# Altium project Hardware-Smartwatch.PrjPcb
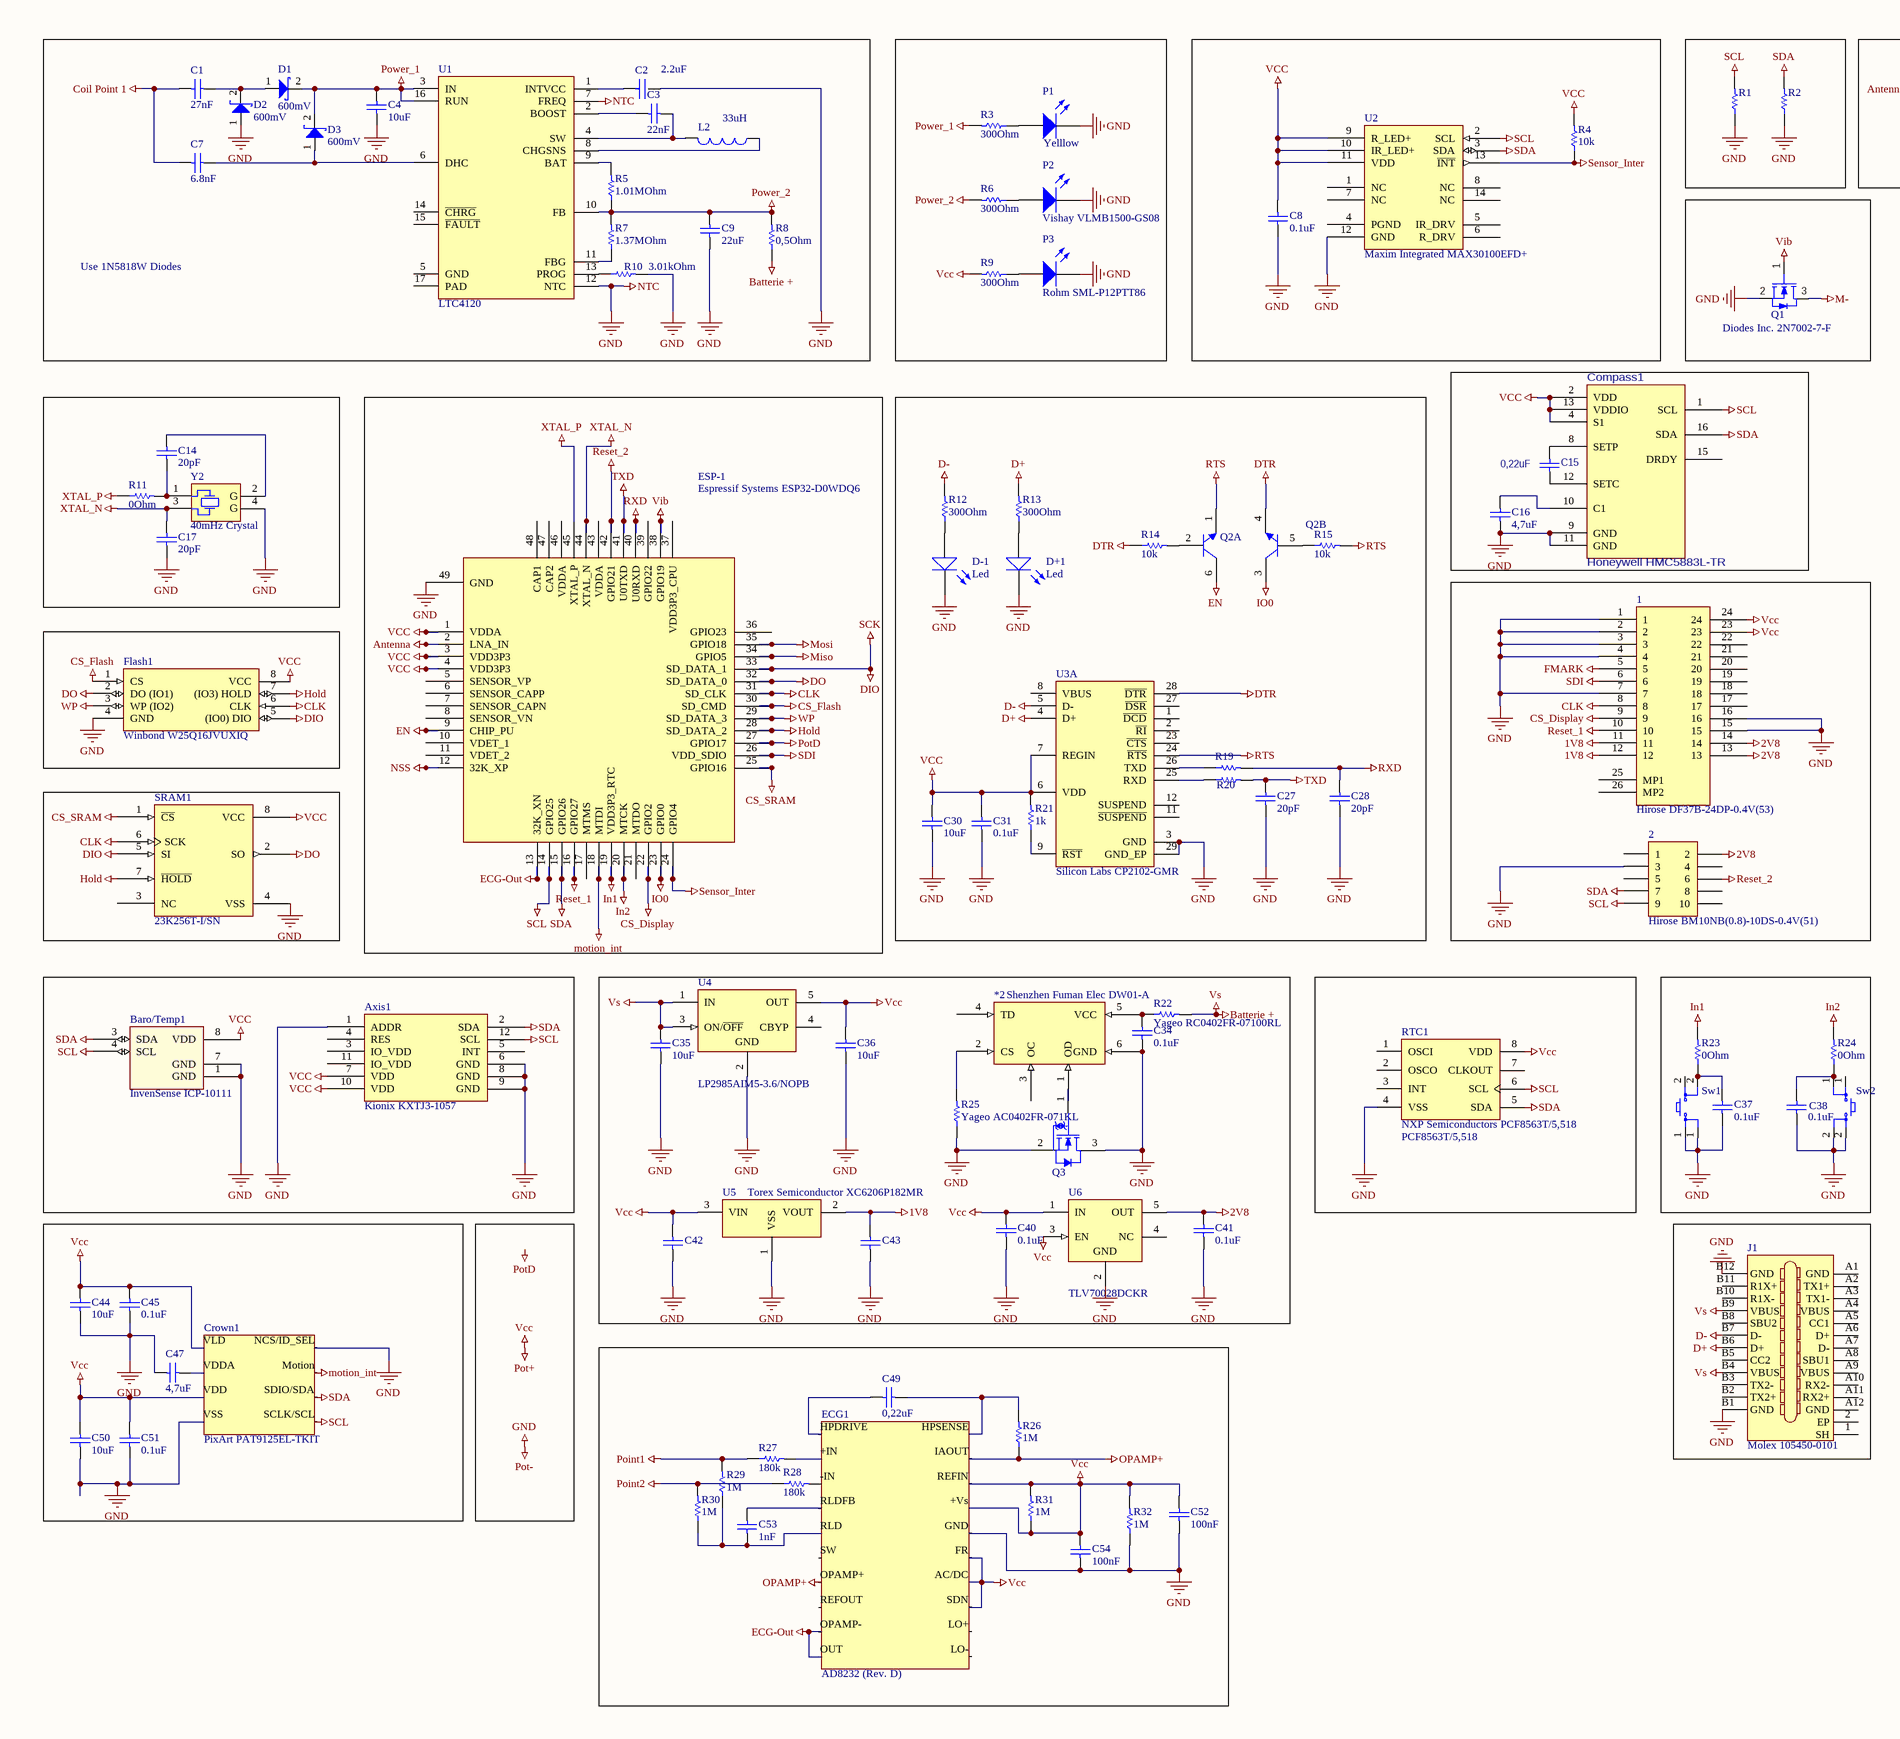
[diagram p0: Prototype1.SchDoc, left]
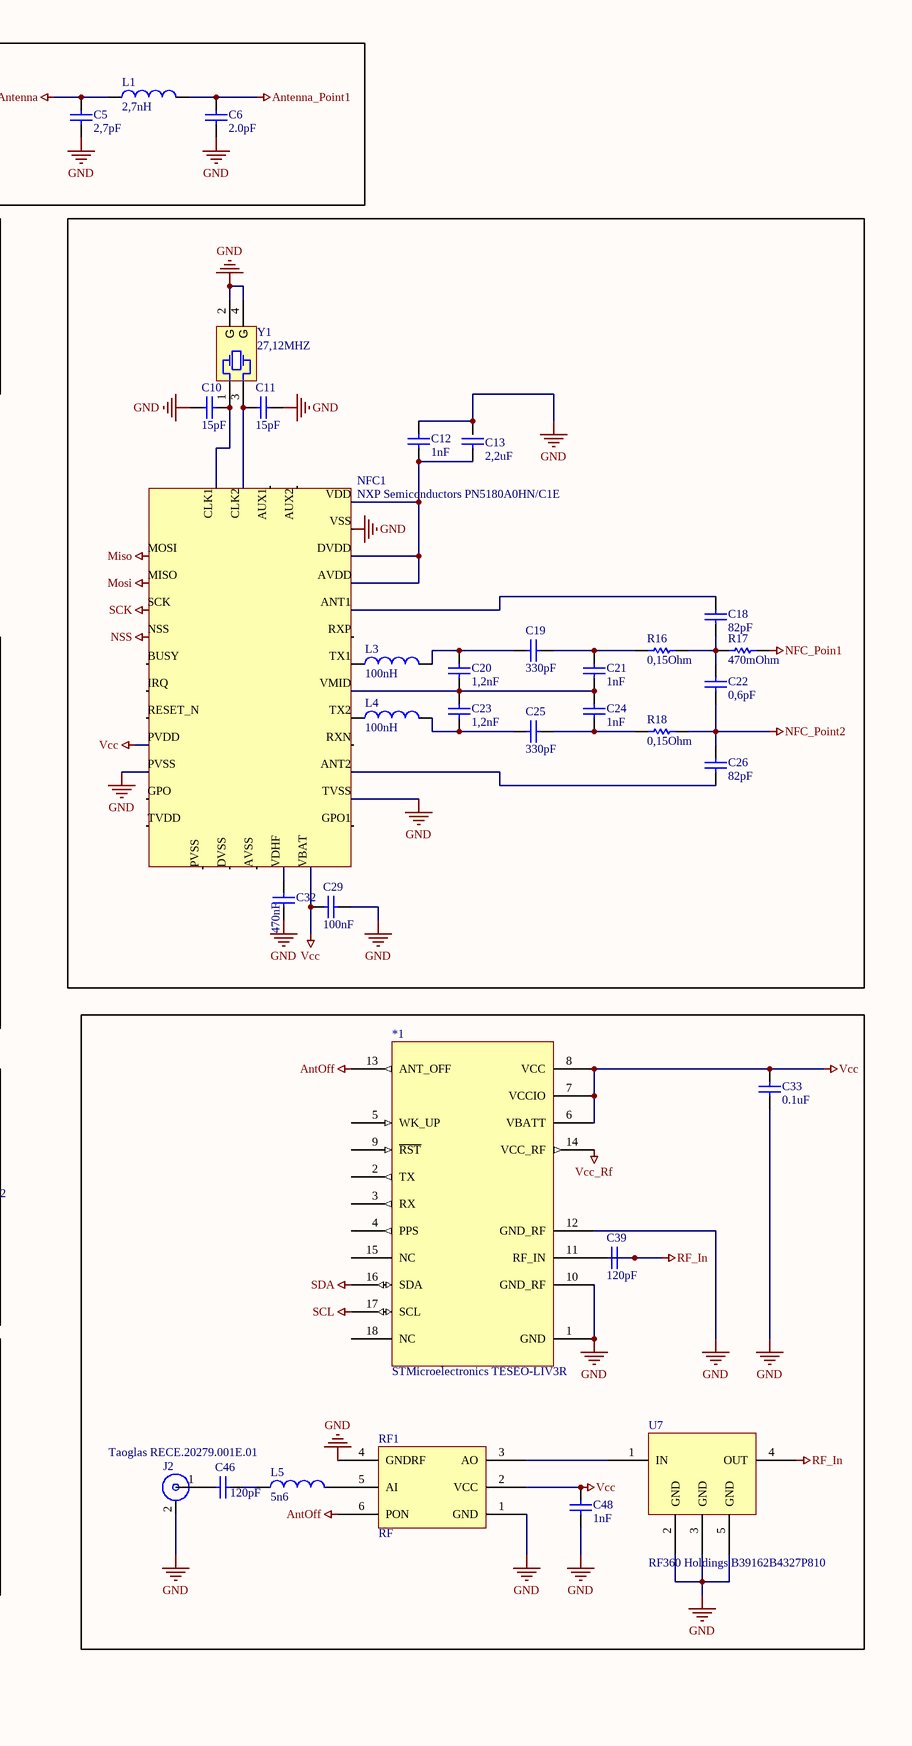
[diagram p1: Prototype1.SchDoc, right]
1 sheet, 130 parts. Net scope: global (net labels, ports and power ports of the same name join across sheets).

## Sheet Prototype1.SchDoc
size A2; SheetNumber: 1; SheetTotal: 1

### Parts
1  Hirose DF37B-24DP-0.4V(53)  [PCBComponent_1]
2  Hirose BM10NB(0.8)-10DS-0.4V(51)  [PCB-u3zw0tki9uf6kmg31iqn-1]
*1  STMicroelectronics TESEO-LIV3R  [PCB-u3hgvlwbh1fojz4efx6r-1]
*2  Shenzhen Fuman Elec DW01-A  [SOT-23-OT6_M]
Axis1  Kionix KXTJ3-1057  [LGA-12]
Baro/Temp1  InvenSense ICP-10111  [LGA]
C1  27nF  [CAPC1005X60X30LL05T10]
C2  2.2uF  [PCBComponent_1]
C3  22nF  [CAPC1005X55X25ML05T10]
C4  10uF  [PCB-lttyq4g1lvuzst7phzli-1]
C5  2,7pF  [CAPC0603X33X15NL03T05]
C6  2.0pF  [CAPC1005X55X25LL05T10]
C7  6.8nF  [CAPC1005X55X30ML05T10]
C8  0.1uF  [PCB-4i05r4rk4159wp88m495-1]
C9  22uF  [PCB-b20vf2gkp97cr3yguehn-1]
C10  15pF  [PCB-wc38oeditvpn9r3qsjf8-1]
C11  15pF  [PCB-wc38oeditvpn9r3qsjf8-1]
C12  1nF  [CAPC1005X56X25NL10T15]
C13  2,2uF  [PCBComponent_1]
C14  20pF  [PCB-rnv6v97ozil7y8g0pmlh-1]
C15  0,22uF  [Samsung CL05A224KO5NNNC-Footprint-1]
C16  4,7uF  [PCB-igt9wm9mf6kdh4ygcups-1]
C17  20pF  [PCB-rnv6v97ozil7y8g0pmlh-1]
C18  82pF  [CAPC1005X55X25LL05T10]
C19  330pF  [CAPC1005X55X25LL05T10]
C20  1,2nF  [CAPC1005X55X25NL05T10]
C21  1nF  [CAPC1005X56X25NL10T15]
C22  0,6pF  [CAPC1005X55X25ML05T10]
C23  1,2nF  [CAPC1005X55X25NL05T10]
C24  1nF  [CAPC1005X56X25NL10T15]
C25  330pF  [CAPC1005X55X25LL05T10]
C26  82pF  [CAPC1005X55X25LL05T10]
C27  20pF  [PCB-rnv6v97ozil7y8g0pmlh-1]
C28  20pF  [PCB-rnv6v97ozil7y8g0pmlh-1]
C29  100nF  [PCB-b20vf2gkp97cr3yguehn-1]
C30  10uF  [PCB-a41llqp6xpt8gy62f2hk-1]
C31  0.1uF  [PCB-4i05r4rk4159wp88m495-1]
C32  470nF  [PCB-8tuutlkq7p1aj3t2dfdp-1]
C33  0.1uF  [PCB-4i05r4rk4159wp88m495-1]
C34  0.1uF  [PCB-4i05r4rk4159wp88m495-1]
C35  10uF  [PCB-lttyq4g1lvuzst7phzli-1]
C36  10uF  [PCB-lttyq4g1lvuzst7phzli-1]
C37  0.1uF  [PCB-4i05r4rk4159wp88m495-1]
C38  0.1uF  [PCB-4i05r4rk4159wp88m495-1]
C39  120pF  [CAPC1005X55X25NL05T10]
C40  0.1uF  [PCB-4i05r4rk4159wp88m495-1]
C41  0.1uF  [PCB-4i05r4rk4159wp88m495-1]
C42  (no value)  [PCB-2o8y9rvhkwcvfcailoy7-1]
C43  (no value)  [PCB-2o8y9rvhkwcvfcailoy7-1]
C44  10uF  [PCB-lttyq4g1lvuzst7phzli-1]
C45  0.1uF  [PCB-4i05r4rk4159wp88m495-1]
C46  120pF  [CAPC1005X55X25NL05T10]
C47  4,7uF  [PCB-9qymwl9t0y1bq7iwb9rx-1]
C48  1nF  [CAPC1005X56X25NL10T15]
C49  0,22uF  [CAPC1005X55X25NL05T10]
C50  10uF  [PCB-lttyq4g1lvuzst7phzli-1]
C51  0.1uF  [PCB-4i05r4rk4159wp88m495-1]
C52  100nF  [PCB-b20vf2gkp97cr3yguehn-1]
C53  1nF  [CAPC1005X56X25NL10T15]
C54  100nF  [PCB-b20vf2gkp97cr3yguehn-1]
Compass1  Honeywell HMC5883L-TR  [PCB-2968744-2]
Crown1  PixArt PAT9125EL-TKIT  [PixArt PAT9125EL-TKIT-Footprint-1]
D1  600mV  [ONSC-SOD-123-2-425-04_V]
D2  600mV  [ONSC-SOD-123-2-425-04_V]
D3  600mV  [ONSC-SOD-123-2-425-04_V]
D+1  Led  [LED-0402]
D-1  Led  [LED-0402]
ECG1  AD8232 (Rev. D)  [New footprint 1]
ESP-1  Espressif Systems ESP32-D0WDQ6  [PCB-i0ipgkgimgjttn9ruy0i-1]
Flash1  Winbond W25Q16JVUXIQ  [MXIC-USON-8_V]
J1  Molex 105450-0101  [PCB-zuuv2u5tezfwori2z0s2-1]
J2  Taoglas RECE.20279.001E.01  [PCB-golsi5rrai9s3p77h0ow-1]
L1  2,7nH  [PCB-4fmjq88xgxe0pf6g45vt-1]
L2  33uH  [PCB-crnfwttg3wkipbuqaprv-1]
L3  100nH  [CAPC1005X60X30LL05T10]
L4  100nH  [CAPC1005X60X30LL05T10]
L5  5n6  [INDC1005X06N]
NFC1  NXP Semiconductors PN5180A0HN/C1E  [NXP Semiconductors PN5180A0HN_C1E-Footprint-1]
P1  Yelllow  [PCB-89oypsq879wwpt3swtto-1]
P2  Vishay VLMB1500-GS08  [PCB-5g2cap63tq137py3r0gr-1]
P3  Rohm SML-P12PTT86  [PCB-fvln992s2sfnqnba174z-1]
Q1  Diodes Inc. 2N7002-7-F  [PCB-mndh2ao1q7oim2ifpjxf-1]
Q2  (no value)  [ONSC-SOT-363-6-419B-02_W_V]  (parts A,B of 2)
Q3  (no value)  [PCB-wwee15y6zmt5extocly2-1]
R1  (no value)  [RESC1005X37X25LL05T10]
R2  (no value)  [RESC1005X37X25LL05T10]
R3  300Ohm  [RESC1005X40X25ML05T10]
R4  10k  [RESC1005X37X25NL05T10]
R5  1.01MOhm  [PCB-1tvcz1kgsq38xqp5t8gc-1]
R6  300Ohm  [RESC1005X40X25ML05T10]
R7  1.37MOhm  [RESC3116X65X40NL10T20]
R8  0,5Ohm  [RESC1005X40X25ML10T10]
R9  300Ohm  [RESC1005X40X25ML05T10]
R10  3.01kOhm  [RESC1005X40X25ML05T05]
R11  0Ohm  [Yageo RC0402FR-070RL-Footprint-2]
R12  300Ohm  [RESC1005X40X25ML05T10]
R13  300Ohm  [RESC1005X40X25ML05T10]
R14  10k  [RESC1005X37X25NL05T10]
R15  10k  [RESC1005X37X25NL05T10]
R16  0,15Ohm  [RESC1005X40X25LL10T10]
R17  470mOhm  [RESC1005X40X25ML10T10]
R18  0,15Ohm  [RESC1005X40X25LL10T10]
R19  (no value)  [Yageo RC0402FR-070RL-Footprint-2]
R20  (no value)  [Yageo RC0402FR-070RL-Footprint-2]
R21  1k  [RESC1005X37X25LL05T10]
R22  Yageo RC0402FR-07100RL  [RESC1005X40X20NL05T10]
R23  0Ohm  [Yageo RC0402FR-070RL-Footprint-2]
R24  0Ohm  [Yageo RC0402FR-070RL-Footprint-2]
R25  Yageo AC0402FR-071KL  [RESC1005X37X25LL05T10]
R26  1M  [RESC1005X40X25NL05T10]
R27  180k  [0402R]
R28  180k  [0402R]
R29  1M  [RESC1005X40X25NL05T10]
R30  1M  [RESC1005X40X25NL05T10]
R31  1M  [RESC1005X40X25NL05T10]
R32  1M  [RESC1005X40X25NL05T10]
RF1  RF  [PCB-h91j38j7fiz7nduy8522-1]
RTC1  NXP Semiconductors PCF8563T/5,518  Manufacturer Part Number: PCF8563T/5,518  [PCB-mkdigkdyo5adg2mbgdfg-1]
SRAM1  23K256T-I/SN  [SOIC-SN8_M]
Sw1  (no value)  [PCB-9lguhjxtz3hxtv6sow1n-1]
Sw2  (no value)  [PCB-9lguhjxtz3hxtv6sow1n-1]
U1  LTC4120  [PCB-zah3is8l8nrgpohakmjs-1]
U2  Maxim Integrated MAX30100EFD+  [OLGA14]
U3  Silicon Labs CP2102-GMR  [QFN50P500X500X100_HS-29N]  (part A of 2)
U4  LP2985AIM5-3.6/NOPB  [MF05A_L]
U5  Torex Semiconductor XC6206P182MR  [SOT-23-3]
U6  TLV70028DCKR  [TI-DCK5_V]
U7  RF360 Holdings B39162B4327P810  [RF360 Holdings B39162B4327P810-Footprint-1]
Y1  27,12MHZ  [PCB-56e43dtnb7esksvnne1a-1]
Y2  40mHz Crystal  [DFN160P250X80-4N]

### Blocks framed on the sheet
Use 1N5818W Diodes: C1-C4 C7 C9 D1-D3 L2 R5 R7 R8 R10 U1

### Nets
1V8: 1.11 1.12 C43.2 U5.2(VOUT)
2V8: 1.13 1.14 2.2 C41.2 U6.5(OUT)
Antenna: C5.2 ESP-1.2(LNA_IN) L1.1
Antenna_Point1: C6.2 L1.2
AntOff: *1.13(ANT_OFF) RF1.6(PON)
Batterie +: C35.2 J1.B4(VBUS) J1.B9(VBUS) R8.1 R22.2 U4.1(IN) U4.3(ON/~{OFF})  [also labelled Vs]
CLK: 1.8 ESP-1.31(SD_CLK) Flash1.6(CLK) SRAM1.6(SCK)
Coil Point 1: C1.1 C7.1
CS_Display: 1.9 ESP-1.22(GPIO2)
CS_Flash: ESP-1.30(SD_CMD) Flash1.1(CS)
CS_SRAM: ESP-1.25(GPIO16) SRAM1.1(~{CS})
D+: J1.B6(D+) R13.2 U3.4(D+)
D-: J1.B7(D-) R12.2 U3.5(D-)
DIO: ESP-1.33(SD_DATA_1) Flash1.5((IO0)_DIO) NFC1.SCK SRAM1.5(SI)  [also labelled SCK]
DO: ESP-1.32(SD_DATA_0) Flash1.2(DO_(IO1)) SRAM1.2(SO)
DTR: Q2.4(E) R14.1 U3.28(~{DTR})
ECG-Out: ECG1.OPAMP- ECG1.OUT ESP-1.13(32K_XN)
EN: ESP-1.9(CHIP_PU) Q2.6(C)
FMARK: 1.5
GND: 1.1 1.2 1.3 1.4 1.7 1.15 1.16 2.3 *1.1(GND) *1.10(GND_RF) *1.12(GND_RF) *2.6(GND) Axis1.1(ADDR) Axis1.6(GND) Axis1.8(GND) Axis1.9(GND) Baro/Temp1.1(GND) Baro/Temp1.2(RESV) Baro/Temp1.5(RESV) Baro/Temp1.6(RESV) Baro/Temp1.7(GND) C2.2 C4.1 C5.1 C6.1 C8.1 C9.1 C10.2 C11.2 C12.1 C13.2 C16.1 C17.2 C27.2 C28.2 C29.1 C30.1 C31.1 C32.1 C33.1 C34.1 C35.1 C36.1 C37.1 C38.1 C40.1 C41.1 C42.1 C43.1 C44.1 C45.1 C47.1 C48.1 C50.1 C51.1 C52.1 C54.1 Compass1.9(GND) Compass1.11(GND) Crown1.NCS/ID_SEL Crown1.VSS D2.1(A) D+1.C D-1.C ECG1.GND ESP-1.49(GND) Flash1.4(GND) J1.B1(GND) J1.B12(GND) J2.2 NFC1.PVSS NFC1.TVSS NFC1.VSS P1.1(K) P2.2(K) P3.1(K) Q1.2(S) Q3.2(S) Q3.3(D) R1.1 R2.1 R10.2 R25.1 R32.1 RF1.1(GND) RF1.4(GNDRF) RTC1.4(VSS) SRAM1.4(VSS) Sw1.1 Sw2.2(2A) U1.7(FREQ) U1.12(NTC) U2.12(GND) U3.3(GND) U3.29(GND_EP) U4.2(GND) U5.1(VSS) U6.2(GND) U7.2(GND) U7.3(GND) U7.5(GND) Y1.2(GND) Y1.4(GND) Y2.4(GND)  [also labelled NTC, Pot-]
Hold: ESP-1.28(SD_DATA_2) Flash1.7((IO3)_HOLD) SRAM1.7(~{HOLD})
In1: ESP-1.19(VDD3P3_RTC) R23.2
In2: ESP-1.20(MTCK) R24.2
IO0: ESP-1.23(GPIO0) Q2.3(C)
M-: Q1.3(D)
Miso: ESP-1.34(GPIO5) NFC1.MOSI
Mosi: ESP-1.35(GPIO18) NFC1.MISO
motion_int: Crown1.Motion ESP-1.18(MTDI)
NFC_Poin1: R17.2
NFC_Point2: C22.1 C26.2 R18.2
NSS: ESP-1.12(32K_XP) NFC1.NSS
OPAMP+: ECG1.IAOUT ECG1.OPAMP+ R26.1
Point1: R27.1 R29.2
Point2: R28.1 R30.2
Pot+: 1.23 1.24 *1.6(VBATT) *1.7(VCCIO) *1.8(VCC) Axis1.7(VDD) Axis1.10(VDD) Baro/Temp1.8(VDD) C8.2 C29.2 C30.2 C31.2 C33.2 C36.2 C40.2 C42.2 C44.2 C45.2 C48.2 C50.2 C51.2 C52.2 C54.2 Compass1.2(VDD) Compass1.4(S1) Compass1.13(VDDIO) Crown1.VDD Crown1.VLD ECG1.+Vs ECG1.AC/DC ECG1.FR ECG1.REFIN ECG1.SDN ESP-1.1(VDDA) ESP-1.3(VDD3P3) ESP-1.4(VDD3P3) Flash1.8(VCC) NFC1.PVDD NFC1.VBAT R4.2 R9.2 R21.2 R31.1 R31.2 R32.2 RF1.2(VCC) RTC1.8(VDD) SRAM1.8(VCC) U2.9(R_LED+) U2.10(IR_LED+) U2.11(VDD) U3.6(VDD) U3.7(REGIN) U4.5(OUT) U5.3(VIN) U6.1(IN) U6.3(EN)  [also labelled VCC]
PotD: ESP-1.27(GPIO17)
Power_1: C4.2 D1.2(K) D3.2(K) R3.2 U1.3(IN) U1.16(RUN)
Power_2: C9.2 R5.1 R6.2 R7.2 R8.2 U1.10(FB)
Reset_1: 1.10 ESP-1.16(GPIO27)
Reset_2: 2.6 ESP-1.42(GPIO21)
RF_In: C39.1 U7.4(OUT)
RTS: Q2.1(E) R15.2 U3.24(~{RTS})
RXD: C28.1 ESP-1.40(U0RXD) R19.2
SCL: 2.9 *1.17(SCL) Axis1.12(SCL) Baro/Temp1.4(SCL) Compass1.1(SCL) Crown1.SCLK/SCL ESP-1.14(GPIO25) R1.2 RTC1.6(SCL) U2.2(SCL)
SDA: 2.7 *1.16(SDA) Axis1.2(SDA) Baro/Temp1.3(SDA) Compass1.16(SDA) Crown1.SDIO/SDA ESP-1.15(GPIO26) R2.2 RTC1.5(SDA) U2.3(SDA)
SDI: 1.6 ESP-1.26(VDD_SDIO)
Sensor_Inter: ESP-1.24(GPIO4) R4.1 U2.13(~{INT})
TXD: C27.1 ESP-1.41(U0TXD) R20.2
Vcc_Rf: *1.14(VCC_RF)
Vib: ESP-1.38(GPIO19) Q1.1(G)
WP: ESP-1.29(SD_DATA_3) Flash1.3(WP_(IO2))
XTAL_N: C17.1 ESP-1.44(XTAL_N) Y2.3
XTAL_P: ESP-1.45(XTAL_P) R11.1
Net*1_11: *1.11(RF_IN) C39.2
Net*2_1: *2.1(OD) Q3.1(G)
Net*2_2: *2.2(CS) R25.2
Net*2_5: *2.5(VCC) C34.2 R22.1
NetC1_2: C1.2 D1.1(A) D2.2(K)
NetC2_1: C2.1 U1.1(INTVCC)
NetC3_1: C3.1 L2.2 U1.4(SW)
NetC3_2: C3.2 U1.2(BOOST)
NetC7_2: C7.2 D3.1(A) U1.6(DHC)
NetC10_1: C10.1 NFC1.CLK1 Y1.1
NetC11_1: C11.1 NFC1.CLK2 Y1.3
NetC12_2: C12.2 C13.1 NFC1.AVDD NFC1.DVDD NFC1.VDD
NetC14_1: C14.1 Y2.2(GND)
NetC14_2: C14.2 R11.2 Y2.1
NetC15_1: C15.1 Compass1.12(SETC)
NetC15_2: C15.2 Compass1.8(SETP)
NetC16_2: C16.2 Compass1.10(C1)
NetC18_1: C18.1 C22.2 R16.2 R17.1
NetC18_2: C18.2 NFC1.ANT1
NetC19_1: C19.1 C20.2 L3.2
NetC19_2: C19.2 C21.2 R16.1
NetC20_1: C20.1 C21.1 C23.2 C24.2 NFC1.VMID
NetC23_1: C23.1 C25.1 L4.2
NetC24_1: C24.1 C25.2 R18.1
NetC26_1: C26.1 NFC1.ANT2
NetC32_2: C32.2 NFC1.VDHF
NetC37_2: C37.2 R23.1 Sw1.2(2A)
NetC38_2: C38.2 R24.1 Sw2.1
NetC46_1: C46.1 J2.1
NetC46_2: C46.2 L5.1
NetC47_2: C47.2 Crown1.VDDA
NetC49_1: C49.1 ECG1.HPDRIVE
NetC49_2: C49.2 ECG1.HPSENSE R26.2
NetC53_1: C53.1 ECG1.RLD R29.1 R30.1
NetC53_2: C53.2 ECG1.RLDFB
NetD+1_A: D+1.A R13.1
NetD-1_A: D-1.A R12.1
NetECG1_+IN: ECG1.+IN R27.2
NetECG1_-IN: ECG1.-IN R28.2
NetL2_1: L2.1 U1.8(CHGSNS)
NetL3_1: L3.1 NFC1.TX1
NetL4_1: L4.1 NFC1.TX2
NetL5_2: L5.2 RF1.5(AI)
NetP1_2: P1.2(A) R3.1
NetP2_1: P2.1(A) R6.1
NetP3_2: P3.2(A) R9.1
NetQ2_2: Q2.2(B) R14.2
NetQ2_5: Q2.5(B) R15.1
NetR5_2: R5.2 U1.9(BAT)
NetR7_1: R7.1 U1.11(FBG)
NetR10_1: R10.1 U1.13(PROG)
NetR19_1: R19.1 U3.26(TXD)
NetR20_1: R20.1 U3.25(RXD)
NetR21_1: R21.1 U3.9(~{RST})
NetRF1_3: RF1.3(AO) U7.1(IN)

Not connected (* = marked no-connect by the designer): 1 17 18 19 20 21 22 25(MP1) 26(MP2); 2 1 4 5 8 10; *1 2(TX) 3(RX) 4(PPS) 5(WK_UP) 9(~{RST}) 15(NC) 18(NC); *2 3(OC) 4(TD); Axis1 3(IO_VDD) 4(RES) 5(INT) 11(IO_VDD); Compass1 15(DRDY); ECG1 LO+ LO- REFOUT SW; ESP-1 5(SENSOR_VP) 6(SENSOR_CAPP) 7(SENSOR_CAPN) 8(SENSOR_VN) 10(VDET_1) 11(VDET_2) 17(MTMS) 21(MTDO) 36(GPIO23) 37(VDD3P3_CPU) 39(GPIO22) 43(VDDA) 46(VDDA) 47(CAP2) 48(CAP1); J1 1(SH) 2(EP) A1(GND) A2(TX1+) A3(TX1-) A4(VBUS) A5(CC1) A6(D+) A7(D-) A8(SBU1) A9(VBUS) A10(RX2-) A11(RX2+) A12(GND) B2(TX2+) B3(TX2-) B5(CC2) B8(SBU2) B10(R1X-) B11(R1X+); NFC1 AUX1 AUX2 AVSS BUSY DVSS GPO GPO1 IRQ RESET_N RXN RXP TVDD; RTC1 1(OSCI) 2(OSCO) 3(INT) 7(CLKOUT); SRAM1 3(NC); U1 5(GND) 14(~{CHRG}) 15(~{FAULT}) 17(PAD); U2 1(NC) 4(PGND) 5(IR_DRV) 6(R_DRV) 7(NC) 8(NC) 14(NC); U3 1(~{DCD}) 2(~{RI}) 8(VBUS) 11(~{SUSPEND}) 12(SUSPEND) 23(~{CTS}) 27(~{DSR}); U4 4(CBYP); U6 4(NC)

### Notes on the sheet
- Labels drawn without touching a wire or pin: PotD
- (in symbol CMP-6073a867ade6bfb4-1) G
- (in symbol CMP-lm3x3di7cwhelc99d68i-2) G

### Library data of the parts
1 = CMP-8e184631a11551df-1: Conn Board to Board HDR 24 POS 0.4mm Solder ST SMD Embossed T/R; Lead-Free Status: Lead Free; Gender: Male; RoHS: Compliant; Octopart URL: https://octopart.com/df37b-24dp-0.4v%2853%29-hirose-19073643; Manufacturer Part Number: DF37B-24DP-0.4V(53); Footprint: PCB-b3nupnfmlm5i4i0jm9x8-1; Contact Material: Phosphor Bronze; OctopartID: 8e184631a11551df; Packaging: Reel; Contact Plating: Gold; Mounting Style: Surface Mount
2 = CMP-679fafb648a7b858-4: Conn Board to Board RCP 10 POS 0.4mm Solder ST SMD Embossed T/R; Gender: Female; Contact Material: Phosphor Bronze; Manufacturer Part Number: BM10NB(0.8)-10DS-0.4V(51); RoHS: Compliant; OctopartID: 679fafb648a7b858; Contact Plating: Gold; Mounting Style: Surface Mount; Packaging: Reel; Octopart URL: http://octopart.com/bm10nb%280.8%29-10ds-0.4v%2851%29-hirose-19073630; Footprint: PCB-u3zw0tki9uf6kmg31iqn-3
*1 = CMP-2292ed94a740fd55-1: GPS Receiver 1575.42MHz 4.3V Automotive 18-Pin LLCC T/R; Octopart URL: https://octopart.com/teseo-liv3r-stmicroelectronics-101490868; OctopartID: 2292ed94a740fd55; Lifecycle Status: Not Listed by Manufacturer; Manufacturer Part Number: TESEO-LIV3R
*2 = CMP-20a0eece0df0ff67-1: SOT-23-6 Battery Management ICs ROHS; Octopart Url: https://octopart.com/dw01-a-shenzhen+fuman+elec-123996214; OctopartID: 20a0eece0df0ff67; Manufacturer Part Number: DW01-A
Axis1 = CMP-a0826d1fa6c97f45-10: Tri-Axis, User Selectable ± 2g, 4g, 8g, 16g, Digital (I2C) Interface and Motion; Supply Voltage (DC): 1.71 V (min), 3.60 V (max); Lead-Free Status: Lead Free; RoHS: Compliant; Packaging: Cut Tape (CT); Manufacturer Part Number: KXTJ3-1057; Octopart URL: https://octopart.com/kxtj3-1057-kionix-77013805; Footprint: PCB-19646338-12; OctopartID: a0826d1fa6c97f45
Baro/Temp1 = CMP-b01e7c8a0af36fd9-2: Barometric Pressure/Temperature Sensor Digital 30kPa to 110kPa/-20 to 65°C 8-Pin LGA T/R; Manufacturer Part Number: ICP-10111; Octopart URL: https://octopart.com/icp-10111-invensense-94281611; OctopartID: b01e7c8a0af36fd9; Footprint: PCB-xjhigi64ti04gzxyhg29-1
C1 = CMP-124778-2: CAP CER 0.027UF 16V 5% X7R 0402; Manufacturer Part Number: C0402C273J4RACTU; Capacitance: 2.7e-08 F; Dielectric Material: Ceramic; Lead-Free Status: R; Voltage Rating (DC): 16.0 V; Capacitance Tolerance: ±5%; Case/Package: 0402; Dielectric Characteristic: X7R; Mounting Style: Surface Mount; Octopart Url: https://octopart.com/c0402c273j4ractu-kemet-17308055; OctopartID: f4c03cc2c8312b07; RoHS: Compliant
C2 C13 = CMP-eb9423b056183453-1: Cap Ceramic 2.2uF 6.3V X5R 20% SMD 0402 85°C Paper T/R; Manufacturer Part Number: CL05A225MQ5NSNC; Lead-Free Status: Lead Free; Footprint: PCB-snmx76k49jswq4nvgt6h-1; Octopart URL: https://octopart.com/cl05a225mq5nsnc-samsung-19831018; OctopartID: eb9423b056183453; RoHS: Compliant
C3 = CMP-3558712-2: Multilayer Ceramic Capacitors MLCC - SMD/SMT 0.022uF 25Volts X7R 10%; Manufacturer Part Number: GCM155R71E223KA55J; Capacitance: 2.2e-08 F; Voltage Rating (DC): 25.0 V; Capacitance Tolerance: ±10%; Dielectric Characteristic: X7R; Octopart Url: https://octopart.com/gcm155r71e223ka55j-murata-17909662; OctopartID: e91e21058be636d9; RoHS: Compliant
C4 C35 C36 C44 C50 = CMP-eacb22ede71a350c-10: Multilayer Ceramic Capacitors MLCC - SMD/SMT 10UF 6.3V 20% 0402; Manufacturer Part Number: GRM155R60J106ME44D; Lead-Free Status: Lead Free; Dielectric Characteristic: X5R; Voltage Rating (DC): 6.30 V; Capacitance: 10.0 µF; Size-Width: 500 µm; Size-Thickness: 500 µm; Operating Temperature: -55.0 °C to 85.0 °C; Case/Package: 0402; REACH SVHC Compliance: No SVHC; OctopartID: eacb22ede71a350c; Capacitance Tolerance: ±20%; Mounting Style: Surface Mount; Size-Length: 1.00 mm; RoHS: Compliant; Octopart URL: https://octopart.com/grm155r60j106me44d-murata-19671223; Packaging: Cut Tape (CT), Tape & Reel (TR)
C5 = CMP-8248623-2: Multilayer Ceramic Capacitors MLCC - SMD/SMT 0201 2.7pF 25volts C0G +/-0.25pF; Manufacturer Part Number: GRM0335C1E2R7CA01D; Capacitance: 2.7e-12 F; Case/Package (SI): 0603; Dielectric Characteristic: C0G/NP0; Lead-Free Status: Lead Free; Voltage Rating (DC): 25.0 V; Lifecycle Status: Active; Octopart Url: https://octopart.com/grm0335c1e2r7ca01d-murata-24611300; OctopartID: 8f4d473023cf508a; RoHS: Compliant; Size-Length: 0.0006 m; Size-Thickness: 0.0003 m; Size-Width: 0.0003 m
C6 = CMP-2265470-2: Multilayer Ceramic Capacitors MLCC - SMD/SMT 0402 2.0pF 50Volts C0G +/-0.1pF; Manufacturer Part Number: GJM1555C1H2R0BB01D; Capacitance: 2e-12 F; Dielectric Characteristic: C0G/NP0; Lead-Free Status: Lead Free; Voltage Rating (DC): 50.0 V; Number of Pins: 2; Octopart Url: https://octopart.com/gjm1555c1h2r0bb01d-murata-4680453; OctopartID: 1601df4c5862c9c6; Packaging: Cut Tape (CT); REACH SVHC Compliance: No SVHC; RoHS: Compliant; Size-Length: 0.001 m; Size-Thickness: 0.0005 m; Size-Width: 0.0005 m
C7 = CMP-124295-2: CAP CER 6800PF 50V 10% X7R 0402; Manufacturer Part Number: C0402C682K5RACTU; Capacitance: 6.8e-09 F; Dielectric Material: Ceramic; Lead-Free Status: R; Voltage Rating (DC): 50.0 V; Capacitance Tolerance: ±10%; Case/Package: 0402; Dielectric Characteristic: X7R; Mounting Style: Surface Mount; Number of Pins: 2; Octopart Url: https://octopart.com/c0402c682k5ractu-kemet-101578; OctopartID: 9ad553de33794512; Packaging: Cut Tape (CT); REACH SVHC Compliance: No SVHC; RoHS: Compliant; Size-Height: 0.0005 m; Size-Length: 0.001 m; Size-Width: 0.0005 m
C8 C31 C33 C34 C37 C38 C40 C41 C45 C51 = CMP-492b82a5f65d96ec-4: 0402 0.1 uF 16 V ±10 % Tolerance X7R SMT Multilayer Ceramic Capacitor; Manufacturer Part Number: CC0402KRX7R7BB104; Capacitance Tolerance: ±10%; Voltage Rating (DC): 16.0 V; Lead-Free Status: Lead Free; Capacitance: 100 nF; REACH SVHC Compliance: No SVHC; Packaging: Cut Tape (CT), Tape & Reel (TR); RoHS: Compliant; Operating Temperature: -55.0 °C to 125 °C; Halogen Free Status: Halogen Free; Mounting Style: Surface Mount; Octopart URL: https://octopart.com/cc0402krx7r7bb104-yageo-42244624; Dielectric Characteristic: X7R; Number of Pins: 2; Case/Package: 0402; OctopartID: 492b82a5f65d96ec
C9 = CMP-2342ef2b2152fc85-1: Cap Ceramic 22uF 6.3V X5R 20% SMD 0402 85°C Paper T/R; Manufacturer Part Number: CC0402MRX5R5BB226; Lead-Free Status: Lead Free; Capacitance: 22.0 µF; Voltage Rating (DC): 6.30 V; Capacitance Tolerance: ±20%; RoHS: Compliant; Case/Package: 0402; Value: 22uF; OctopartID: 2342ef2b2152fc85; Dielectric Characteristic: X5R; Mounting Style: Surface Mount; Octopart URL: https://octopart.com/cc0402mrx5r5bb226-yageo-90384246; Halogen Free Status: Halogen Free
C10 C11 = CMP-cb1f0298578c14d8-1: 0805 15 pF 50 V ±5 % Tolerance NPO Surface Mount Ceramic Capacitor; Manufacturer Part Number: CC0805JRNPO9BN150; Voltage Rating (DC): 50.0 V; Dielectric Characteristic: C0G/NP0; Capacitance Tolerance: ±5%; Lead-Free Status: Lead Free; Capacitance: 1.5e-11 F; OctopartID: cb1f0298578c14d8; Case/Package: 0805; Octopart URL: http://octopart.com/cc0805jrnpo9bn150-yageo-9288181; Number of Pins: 2; RoHS: Compliant; Halogen Free Status: Halogen Free; Mounting Style: Surface Mount
C12 C21 C24 C48 C53 = CMP-3a37f3b0aa79e5f0-2: Surface Mount Ceramic Multilayer Capacitor 0.001uF 5% X7R 50V 0402 Paper T/R; Manufacturer Part Number: CC0402JRX7R9BB102; Capacitance: 1.00 nF; Voltage Rating (DC): 50.0 V; Lead-Free Status: Lead Free; Footprint: PCB-0002-00476-3; Case/Package: 0402; Packaging: Cut Tape (CT); OctopartID: 3a37f3b0aa79e5f0; Octopart URL: https://octopart.com/cc0402jrx7r9bb102-yageo-9286952; Capacitance Tolerance: ±5%; RoHS: Compliant; Dielectric Characteristic: X7R; Operating Temperature: -55.0 °C to 125 °C; Mounting Style: Surface Mount; Halogen Free Status: Halogen Free; Number of Pins: 2
C14 C17 C27 C28 = CMP-c23c0bbb515b1dfb-3: 0402 20 pF 50 V ±5 % Tolerance NP0 SMT Multilayer Ceramic Capacitor; Manufacturer Part Number: CC0402JRNPO9BN200; Voltage Rating (DC): 50.0 V; Dielectric Characteristic: C0G/NP0; Lead-Free Status: Lead Free; Capacitance: 20.0 pF; Capacitance Tolerance: ±5%; OctopartID: c23c0bbb515b1dfb; RoHS: Compliant; Octopart Url: http://octopart.com/cc0402jrnpo9bn200-yageo-9287169; Seller Landing  Url: https://octopart-clicks.com/click/track?country=US&ak=8157f166&sig=0db7fc5&sid=1106&ppid=9287169&vpid=198823824&ct=offers; Packaging: Cut Tape (CT); Mounting Style: Surface Mount; Number of Pins: 2; Case/Package: 0402; Halogen Free Status: Halogen Free; Footprint: PCB-p33n3j6uepxmkh02isin-1
C15 = CMP-775fbf298173a898-2: CL05 Series 0402 0.22 uF 16 V ±10% X5R Multilayer Ceramic Capacitor; Manufacturer Part Number: CL05A224KO5NNNC; Lead-Free Status: Lead Free; Capacitance: 220 nF; Voltage Rating (DC): 16.0 V; Case/Package: 0402; Capacitance Tolerance: ±10%; Mounting Style: Surface Mount; Octopart Url: https://octopart.com/cl05a224ko5nnnc-samsung-24957770; Operating Temperature: -55.0 °C (min); Dielectric Characteristic: X5R; OctopartID: 775fbf298173a898; Packaging: Tape & Reel (TR); RoHS: Compliant
C16 = CMP-5caa96c6827f836d-4: 4.7µF ±20% 10V Ceramic Capacitor X5R 0402 (1005 Metric); Manufacturer: Yageo; Manufacturer Part Number: CC0402MRX5R6BB475; Lead-Free Status: Lead Free; Voltage Rating (DC): 10.0 V; Capacitance: 4.7uF; RoHS: Compliant; Dielectric Characteristic: X5R; Halogen Free Status: Halogen Free; Packaging: Tape & Reel (TR); Case/Package: 0402; Octopart URL: https://octopart.com/cc0402mrx5r6bb475-yageo-57080755; Capacitance Tolerance: ±20%; Mounting Style: Surface Mount; OctopartID: 5caa96c6827f836d; Supplier Part Number: 311-1734-2-ND; Supplier: Digi-Key
C18 C26 = CMP-2511185-3: Multilayer Ceramic Capacitors MLCC - SMD/SMT 0402 82pF 50volts C0G 5%; Manufacturer Part Number: GRM1555C1H820JA01D; Manufacturer: Murata; Voltage Rating (DC): 50.0 V; Capacitance: 8.2e-11 F; Lead-Free Status: Lead Free; Dielectric Characteristic: C0G/NP0; OctopartID: f00039fa98732fc7; REACH SVHC Compliance: No SVHC; Size-Thickness: 0.0005 m; Capacitance Tolerance: ±5%; Octopart Url: https://octopart.com/grm1555c1h820ja01d-murata-15748373; RoHS: Compliant; Lifecycle Status: Active; Size-Width: 0.0005 m; Size-Length: 0.001 m
C19 C25 = CMP-132420-2: CAP CER 330PF 100V 10% X7R 0402; Manufacturer Part Number: GRM155R72A331KA01D; Capacitance: 3.3e-10 F; Lead-Free Status: Lead Free; Voltage Rating (DC): 100.0 V; Capacitance Tolerance: ±10%; Dielectric Characteristic: X7R; Lifecycle Status: Active; Octopart Url: https://octopart.com/grm155r72a331ka01d-murata-17746408; OctopartID: 1be6d3e2f768c421; RoHS: Compliant; Size-Length: 0.001 m; Size-Thickness: 0.0005 m; Size-Width: 0.0005 m
C20 C23 = CMP-134898-2: Multilayer Ceramic Capacitors MLCC - SMD/SMT 0402 1200pF 10volt U2J +/-5%; Manufacturer Part Number: GRM1557U1A122JA01D; Capacitance: 1.2e-09 F; Capacitance Tolerance: ±5%; Voltage Rating (DC): 10.0 V; Dielectric Characteristic: U2J; Lifecycle Status: Active; Octopart Url: https://octopart.com/grm1557u1a122ja01d-murata-17757707; OctopartID: 94275c23474a4be0; RoHS: Compliant; Size-Length: 0.001 m; Size-Thickness: 0.0005 m; Size-Width: 0.0005 m
C22 = CMP-3552115-2: Multilayer Ceramic Capacitors MLCC - SMD/SMT 0402 0.60pF 50volts C0G +/-0.1pF; Manufacturer Part Number: GRM1555C1HR60BA01D; Capacitance: 6e-13 F; Dielectric Characteristic: C0G/NP0; Voltage Rating (DC): 50.0 V; Lifecycle Status: Active; Octopart Url: https://octopart.com/grm1555c1hr60ba01d-murata-19769333; OctopartID: e99321b46b003654; RoHS: Compliant; Size-Length: 0.001 m; Size-Thickness: 0.0005 m; Size-Width: 0.0005 m
C29 C52 C54 = CMP-fe6237170bbd21a5-3: 0402 0.1 uF 10 V ±10 % Tolerance X5R SMT Multilayer Ceramic Capacitor; Manufacturer Part Number: CC0402KRX5R6BB104; Voltage Rating (DC): 10.0 V; Lead-Free Status: Lead Free; Capacitance Tolerance: ±10%; Value: 0.1uF; Packaging: Cut Tape (CT); OctopartID: fe6237170bbd21a5; Octopart URL: https://octopart.com/cc0402krx5r6bb104-yageo-8376505; RoHS: Compliant; Operating Temperature: -55.0 °C to 85.0 °C; Dielectric Characteristic: X5R; Halogen Free Status: Halogen Free; Number of Pins: 2; Capacitance: 100 nF; Case/Package: 0402; Mounting Style: Surface Mount
C30 = CMP-fd5e350784e62299-2: Cap Ceramic 10uF 6.3V X5R 20% SMD 0402 85°C Paper T/R; Manufacturer Part Number: CL05A106MQ5NUNC; Lead-Free Status: Lead Free; RoHS: Compliant; Mounting Style: Surface Mount; Octopart URL: https://octopart.com/cl05a106mq5nunc-samsung-22240478; OctopartID: fd5e350784e62299
C32 = CMP-1106d88296b6cec1-2: Cap Ceramic 0.47uF 10V X5R 10% SMD 0402 85°C Paper T/R; Manufacturer Part Number: CL05A474KP5NNNC; Lead-Free Status: Lead Free; Voltage Rating (DC): 10.0 V; Capacitance: 470 nF; Octopart URL: https://octopart.com/cl05a474kp5nnnc-samsung-9347798; Operating Temperature: -55.0 °C (min); Footprint: PCB-8tuutlkq7p1aj3t2dfdp-7; RoHS: Compliant; Capacitance Tolerance: ±10%; Case/Package: 0402; Dielectric Characteristic: X5R; OctopartID: 1106d88296b6cec1
C39 C46 = CMP-132550-2: Multilayer Ceramic Capacitors MLCC - SMD/SMT 120pF 50Volts C0G 5%; Manufacturer Part Number: GCM1555C1H121JA16D; Capacitance: 1.2e-10 F; Dielectric Characteristic: C0G/NP0; Voltage Rating (DC): 50.0 V; Capacitance Tolerance: ±5%; Octopart Url: https://octopart.com/gcm1555c1h121ja16d-murata-17802270; OctopartID: 66e4aee1e79cb923; RoHS: Compliant
C42 C43 = CMP-1984d046933ec643-1: 0402 1 uF 16 V ±10% Tolerance X5R SMT Multilayer Ceramic Capacitor; Manufacturer Part Number: EMK105BJ105KV-F; Lead-Free Status: Lead Free; Voltage Rating (DC): 16.0 V; Capacitance: 1.00 µF; Operating Temperature: -55.0 °C to 85.0 °C; Packaging: Cut Tape (CT); Lifecycle Status: Active; Dielectric Characteristic: X5R; REACH SVHC Compliance: No SVHC; Halogen Free Status: Halogen Free; Octopart URL: https://octopart.com/emk105bj105kv-f-taiyo+yuden-13152220; RoHS: Compliant; Mounting Style: Surface Mount; Case/Package: 0402; Number of Pins: 2; OctopartID: 1984d046933ec643; Capacitance Tolerance: ±10%
C47 = CMP-120737-5: Capacitor: ceramic; 4.7uF; 6.3V; X5R; ±20%; SMD; 0402; Series: GRM; Manufacturer Part Number: GRM155R60J475ME87D; Lead-Free Status: Lead Free; Capacitance: 4.70 µF; Voltage Rating (DC): 6.30 V; Octopart URL: http://octopart.com/grm155r60j475me87d-murata-12608427; Capacitance Tolerance: ±20%; Size-Length: 1.00 mm; Size-Thickness: 500 µm; REACH SVHC Compliance: No SVHC; Lifecycle Status: Active; Packaging: Cut Tape (CT), Tape & Reel (TR); Dielectric Characteristic: X5R; RoHS: Compliant; Size-Width: 500 µm; Case/Package: 0402, 1005; Mounting Style: Surface Mount; OctopartID: aa9d6357ec50755a
C49 = CMP-bd4c7757b9d3628b-1: 0402 0.22 uF 35 V X6S ±10% Tolerance SMT Multilayer Ceramic Capacitor; Manufacturer Part Number: GRM155C8YA224KE01D; Voltage Rating (DC): 35.0 V; Capacitance: 220 nF; Lead-Free Status: Lead Free; Mounting Style: Surface Mount; Size-Length: 1.00 mm; Capacitance Tolerance: ±10%; RoHS: Compliant; Dielectric Characteristic: X6S; OctopartID: bd4c7757b9d3628b; Octopart Url: https://octopart.com/grm155c8ya224ke01d-murata-51454457; Size-Width: 500 µm; Packaging: Tape & Reel (TR); Case/Package: 0402; Size-Thickness: 500 µm
Compass1 = CMP-2968744-5: MAGNETIC SENSOR ON TAPE AND REEL; Manufacturer Part Number: HMC5883L-TR; Number of Pins: 16; OctopartID: b1a37a0cbc0b6e64; Octopart Url: http://octopart.com/hmc5883l-tr-honeywell-44378318; RoHS: Compliant
Crown1 = CMP-1387de2e026fcc40-1: IC, Optical Track Sensor L2C Interface 2.7-3.3V Rohs; Manufacturer Part Number: PAT9125EL-TKIT; Octopart Url: https://octopart.com/pat9125el-tkit-pixart-77804686; OctopartID: 1387de2e026fcc40
D1-D3 = CMP-3b06f52eca51e4c1-1: 40V 600mV@1A 1A SOD-123 Schottky Barrier Diodes (SBD) ROHS; Manufacturer Part Number: B5819W SL; Manufacturer: Changjiang Electronics Tech (CJ); Forward Voltage: 0.45 - 0.9 V; Diode Capacitance: 120 pF; Leakage Current: 1 mA; Breakdown Voltage: 40 V; OctopartID: 3b06f52eca51e4c1; Octopart Url: https://octopart.com/b5819w+sl-changjiang+electronics-119723057; JLCPCB Part#: C8598
D+1 D-1 = CMP-bb377396f3a564f0-1: CHIP LED WHITE DIFFUSED 0402 RoHSconf; Manufacturer Part Number: 16-219A/T2D-AR2T1QY/3T; Octopart Url: http://octopart.com/16-219a%2Ft2d-ar2t1qy%2F3t-everlight-28012020; RoHS: Compliant; Seller Landing  Url: https://octopart-clicks.com/click/track?country=US&ak=8157f166&sig=017fe45&sid=18993&ppid=28012020&vpid=87894537&ct=offers; OctopartID: bb377396f3a564f0
ECG1 = CMP-9g01sqewiw7mcokvksx9-1: CustomComponentID: 9g01sqewiw7mcokvksx9
ESP-1 = CMP-ddea11b058a1022d-5: IC Rf Txrx+mcu Bluetooth 48VFQFN; Manufacturer Part Number: ESP32-D0WDQ6; Octopart URL: https://octopart.com/esp32-d0wdq6-espressif+systems-89169965; Mounting Style: Surface Mount; OctopartID: ddea11b058a1022d
Flash1 = CMP-582395a8cb5187e4-4: NOR Flash Serial-SPI 3V/3.3V 16M-bit 6ns 8-Pad USON 2x3x0.6-mm^³(Package Code UX); RoHS: Compliant; OctopartID: 582395a8cb5187e4; Octopart URL: https://www.winbond.com/resource-files/w25q16jv%20spi%20revh%2004082019%20plus.pdf; Footprint: PCC-0158-00032-1; Manufacturer Part Number: W25Q16JVUXIQ
J1 = CMP-36bdfbb9c94ee97a-9: Conn USB 3.1 Type C RCP 24 POS 0.5mm Solder RA SMD 24 Terminal 1 Port T/R; Gender: Female; Contact Plating: Gold; Orientation: Right Angle; Mounting Style: Surface Mount; Octopart URL: https://octopart.com/105450-0101-molex-68082325; Lifecycle Status: Not Listed by Manufacturer; RoHS: Compliant; Manufacturer Part Number: 105450-0101; Contact Material: Copper Alloy; OctopartID: 36bdfbb9c94ee97a
J2 = CMP-39e3f1282390e624-6: Conn MHF RCP Solder ST SMD Gold; Gender: Male; Packaging: Reel; Manufacturer Part Number: RECE.20279.001E.01; RoHS: Compliant; Mounting Style: Surface Mount; OctopartID: 39e3f1282390e624; Octopart URL: https://octopart.com/rece.20279.001e.01-taoglas-29441813; Footprint: PCB-yqbb1moeza5e4l13f5mb-1
L1 = CMP-5b0c920397bc84cb-2: Inductor RF Chip Multi-Layer 2.7nH 0.3nH 100MHz 8Q-Factor Air 300mA 150mOhm DCR 0402 T/R; Manufacturer Part Number: LQG15HS2N7S02D; Self Resonant Frequency: 6.00 GHz; Lead-Free Status: Lead Free; Shielding: No; Inductance: 2.70 nH; Octopart URL: http://octopart.com/lqg15hs2n7s02d-murata-387542; Size-Height: 500 µm; Packaging: Cut Tape (CT), Tape & Reel (TR); RoHS: Compliant; Mounting Style: Surface Mount; Case/Package: 0402, 1005; Lifecycle Status: Active; Size-Length: 1.00 mm; Footprint: PCB-rcf2dvdngqs7iz8r00pl-1; OctopartID: 5b0c920397bc84cb; Size-Width: 500 µm
L2 = CMP-8e81479511b35146-1: Inductor Chip Shielded Multi-Layer 33uH 10% 400KHz 30Q-Factor Ferrite 5mA 1.25Ohm DCR 0805 T/R; Manufacturer Part Number: CV201210-330K; Inductance: 33.0 µH; Case/Package: 0603; OctopartID: 8e81479511b35146; Packaging: Tape & Reel (TR); Octopart Url: https://octopart.com/cv201210-330k-bourns-2013780; RoHS: Compliant; Mounting Style: Surface Mount
L3 L4 = CMP-8cbb45b0e238537c-1: Inductor RF Chip Multi-Layer 100nH 5% 100MHz 8Q-Factor Air 150mA 1.6Ohm DCR 0402 Paper T/R; Manufacturer Part Number: LQG15HNR10J02D; Lead-Free Status: Lead Free; Self Resonant Frequency: 600 MHz; Resistance: 1.60 Ω; Q-Factor: 8.0; Case/Package: 0402, 1005; Number of Pins: 2; Operating Temperature: -55.0 °C (min); Size-Height: 500 µm; Size-Length: 1.00 mm; Resonant Frequency: 600 MHz; REACH SVHC Compliance: No SVHC; Mounting Style: Surface Mount; Inductance: 100 nH; Size-Width: 500 µm; Lifecycle Status: Active; OctopartID: 8cbb45b0e238537c; Packaging: Tape, Tape & Reel (TR); RoHS: Compliant; Octopart Url: https://octopart.com/lqg15hnr10j02d-murata-84965
L5 = CMP-2ad8e3d7e6fff51f-1: Inductor RF Chip Multi-Layer 5.6nH 0.3nH 100MHz 8Q-Factor Air 300mA 260mOhm DCR 0402 Paper T/R; Manufacturer Part Number: LQG15HN5N6S02D; Lead-Free Status: Lead Free; Inductance: 5.60 nH; Resonant Frequency: 5.30 GHz; Resistance: 260 mΩ; Q-Factor: 8.0; Size-Height: 500 µm; Footprint: PCB-hajpzkvdqypxskke0d0m-1; Lifecycle Status: Active; Octopart URL: http://octopart.com/lqg15hn5n6s02d-murata-387393; Case/Package: 0402, 1005; Number of Pins: 2; REACH SVHC Compliance: No SVHC; RoHS: Compliant; Packaging: Tape, Tape & Reel (TR); Current Rating: 300 mA; Size-Width: 500 µm; Self Resonant Frequency: 5.30 GHz; Mounting Style: Surface Mount; OctopartID: 2ad8e3d7e6fff51f; Size-Length: 1.00 mm
NFC1 = CMP-3e9df3957af4e15a-3: PN5180 Series 2.7 - 5.5 V 13.56 MHz NFC High-power NFC Frontend - HVQFN40; Frequency: 13.6 MHz (max); Supply Voltage (DC): 5.50 V (max), 2.70 V (min); Lead-Free Status: Lead Free; Lifecycle Status: Not Listed by Manufacturer; RoHS: Compliant; Manufacturer Part Number: PN5180A0HN/C1E; Octopart Url: https://octopart.com/pn5180a0hn%2Fc1e-nxp+semiconductors-67264783; OctopartID: 3e9df3957af4e15a
P1 = CMP-63eea8b7bbc8bc29-3: LED Uni-Color Yellow Chip LED 2-Pin 0402 T/R; Manufacturer Part Number: SML-P11YTT86R; Forward Voltage: 1.90 V; Luminous Intensity: 7.60 mcd; Lead-Free Status: Lead Free; RoHS: Compliant; Color: Yellow; Packaging: Cut Tape (CT); Octopart URL: https://octopart.com/sml-p11ytt86r-rohm-39058752; OctopartID: 63eea8b7bbc8bc29; Mounting Style: Surface Mount; Case/Package: 0402
P2 = CMP-4a5d8238da49959a-2: LED Uni-Color Blue 468nm 2-Pin Chip 0402(1006Metric) T/R; Luminous Intensity: 45.0 mcd; Forward Voltage: 3.15 V; Lens Color: Transparent; Lead-Free Status: Lead Free; Viewing Angle: 130 °; OctopartID: 4a5d8238da49959a; Octopart URL: https://octopart.com/vlmb1500-gs08-vishay-24098162; RoHS: Compliant; Manufacturer Part Number: VLMB1500-GS08; Mounting Style: Surface Mount; Packaging: Cut Tape (CT); Case/Package: 0402
P3 = CMP-b5237ca453946ae4-9: SML-P1 Series PICOLED Green 1 x 0.6 x 0.2 mm 13 mcd Clear 20 mA 2.2 V SMT LED; Luminous Intensity: 0.013 cd; Forward Voltage: 2.2 V; Lead-Free Status: Lead Free; Wavelength: 5.6e-07 m; Packaging: Cut Tape (CT); RoHS: Compliant; REACH SVHC Compliance: No SVHC; Color: Green; Case/Package: 0402; Manufacturer Part Number: SML-P12PTT86; Octopart URL: http://octopart.com/sml-p12ptt86-rohm-9290705; OctopartID: b5237ca453946ae4
Q1 = CMP-e39a2a95da213c5d-13: 2N7002-7-F N-Channel MOSFET, 115 mA, 60 V, 3-Pin SOT-23 Diodes Inc; Drain to Source Voltage (Vds): 60.0 V; Breakdown Voltage [Gate to Source]: -20.0 V to 20.0 V; Breakdown Voltage (Drain to Source): 70.0 V; Drain to Source Resistance (on) (Rds): 4.40 Ω; Current Rating: 115 mA; Lead-Free Status: Lead Free; Power Dissipation: 300 mW; Lifecycle Status: Active; OctopartID: e39a2a95da213c5d; Voltage Rating (DC): 60.0 V; Mounting Style: Surface Mount; RoHS: Compliant; Octopart URL: https://octopart.com/2n7002-7-f-diodes+inc.-335069; Case/Package: TO-236, SOT-23-3, SC-59; REACH SVHC Compliance: No SVHC; Packaging: Cut Tape (CT), Tape & Reel (TR); Number of Pins: 3; Polarity: N-Channel; Continuous Drain Current (Ids): 115 mA; Operating Temperature: -55.0 °C to 150 °C; Manufacturer Part Number: 2N7002-7-F
Q2 = CMP-854446-2: Dual General Purpose Transistors, NPN, 6-Pin SOT-363, Pb-Free, Tape and Reel; Manufacturer Part Number: BC847BDW1T1G; Breakdown Voltage [Collector to Emitter]: 45.0 V; Current Rating: 0.1 A; Lead-Free Status: Lead Free; Case/Package: SOT-363; Halogen Free Status: Halogen Free; Lifecycle Status: Active; Mounting Style: Surface Mount; Number of Pins: 6; Octopart Url: https://octopart.com/bc847bdw1t1g-on+semiconductor-1003895; OctopartID: 6398aa9d1789bc5f; REACH SVHC Compliance: No SVHC; RoHS: Compliant; Voltage Rating (DC): 45.0 V
Q3 = CMP-71b2bac8e62bae75-1: MOSFET, Power; N-Ch; VDSS 60V; RDS(ON) 2 Ohms; ID 300mA; TO-236 (SOT-23); PD 0.35W; Manufacturer Part Number: 2N7002K-T1-E3; Polarity: N-Channel; Breakdown Voltage [Gate to Source]: -20.0 V to 20.0 V; Lead-Free Status: Lead Free; Drain to Source Resistance (on) (Rds): 7.50 Ω; Breakdown Voltage (Drain to Source): 70.0 V; Power Dissipation: 200 mW; Continuous Drain Current (Ids): 115 mA; Octopart URL: http://octopart.com/2n7002k-t1-e3-vishay-40940287; OctopartID: 71b2bac8e62bae75; Case/Package: SOT-23; RoHS: Compliant; Number of Pins: 3; Packaging: Reel
R1 R2 R21 = CMP-1900914-2: RES SMD 1K OHM 1% 1/16W 0402; Manufacturer Part Number: AC0402FR-071KL; Lead-Free Status: Lead Free; Resistance: 1000.0 Ω; Case/Package: 0402; Mounting Style: Surface Mount; Octopart Url: https://octopart.com/ac0402fr-071kl-yageo-21711078; OctopartID: fc2c346d91ac23eb; Resistance Tolerance: ±1%; RoHS: Compliant
R3 R6 R9 R12 R13 = CMP-1853111-2: RES SMD 300 OHM 1% 1/16W 0402; Manufacturer Part Number: RC0402FR-07300RL; Lead-Free Status: Lead Free; Power Rating: 0.063 W; Resistance: 300.0 Ω; Voltage Rating (DC): 50.0 V; Case/Package: 0402; Mounting Style: Surface Mount; Number of Pins: 2; Octopart Url: https://octopart.com/rc0402fr-07300rl-yageo-39798431; OctopartID: f5d13e8496282a16; Packaging: Cut Tape (CT); REACH SVHC Compliance: No SVHC; Resistance Tolerance: ±1%; RoHS: Compliant; Size-Height: 0.00035 m; Size-Length: 0.001 m; Size-Width: 0.0005 m
R4 R14 R15 = CMP-7871561-2: Thick Film Resistors - SMD 1/16W 10K ohm 1%; Manufacturer Part Number: AC0402FR-0710KL; Lead-Free Status: Lead Free; Resistance: 10000.0 Ω; Case/Package: 0402; Mounting Style: Surface Mount; Octopart Url: https://octopart.com/ac0402fr-0710kl-yageo-24501938; OctopartID: 270fef70dcdbf8c8; Resistance Tolerance: ±1%; RoHS: Compliant
R5 = CMP-1852847-14: 10 kOhms ±5% 0.063W, 1/16W Chip Resistor 0402 (1005 Metric) Moisture Resistant Thick Film; Manufacturer Part Number: RC0402JR-0710KL; Manufacturer: Yageo; Lead-Free Status: Lead Free; Voltage Rating (DC): 50.0 V; Power Rating: 62.5 mW; Resistance: 10K; REACH SVHC Compliance: No SVHC; Size-Length: 1.00 mm; Number of Pins: 2; Case/Package: 0402; Size-Width: 500 µm; Supplier: Digi-Key; Packaging: Tape & Reel; Octopart URL: http://octopart.com/rc0402jr-0710kl-yageo-55458470; Supplier Part Number: RC0402JR-0710KL; Size-Height: 350 µm; OctopartID: 515f9b1b4e9f8e98; Resistance Tolerance: ±5%; RoHS: Compliant; Mounting Style: Surface Mount
R7 = CMP-1902027-2: RES SMD 1.37M OHM 1% 1/4W 1206; Manufacturer Part Number: RC1206FR-071M37L; Case/Package (SI): 3216; Lead-Free Status: Lead Free; Power Rating: 0.25 W; Resistance: 1370000.0 Ω; Voltage Rating (DC): 200.0 V; Case/Package: 1206; Mounting Style: Surface Mount; Octopart Url: https://octopart.com/rc1206fr-071m37l-yageo-1215813; OctopartID: 064acf52ae69d98d; Resistance Tolerance: ±1%; RoHS: Compliant; Size-Height: 0.00055 m; Size-Length: 0.0032 m; Size-Width: 0.0016 m
R8 = CMP-3661323-2: Thick Film Resistors - SMD 0.5ohm 1% 1/16W / Learn More; Manufacturer Part Number: RL0402FR-070R5L; Lead-Free Status: Lead Free; Resistance: 0.5 Ω; Case/Package: 0402; Mounting Style: Surface Mount; Octopart Url: https://octopart.com/rl0402fr-070r5l-yageo-22605705; OctopartID: a2696a3b68867dae; Resistance Tolerance: ±1%; RoHS: Compliant
R10 = CMP-3654636-2: Thick Film Resistors - SMD 0402 3.01Kohms 1% Tol; Manufacturer Part Number: ERJ-2RKF3011X; Lead-Free Status: Lead Free; Power Rating: 0.1 W; Resistance: 3010.0 Ω; Voltage Rating (DC): 50.0 V; Case/Package: 0402; Lifecycle Status: Not Listed by Manufacturer; Mounting Style: Surface Mount; Octopart Url: https://octopart.com/erj-2rkf3011x-panasonic-55411480; OctopartID: 65b7aff0c3c9ba70; Packaging: Cut Tape (CT); REACH SVHC Compliance: No SVHC; Resistance Tolerance: ±1%; RoHS: Compliant; Size-Height: 0.00035 m; Size-Length: 0.001 m; Size-Width: 0.0005 m
R11 R19 R20 R23 R24 = CMP-1900180-8: RC Series 0402 0.063 W 0 Ohm Jumper Surface Mount Thick Film Chip Resistor; Manufacturer Part Number: RC0402FR-070RL; Resistance Tolerance: ±1%; Resistance: 0R; Lead-Free Status: Lead Free; Octopart URL: https://octopart.com/rc0402fr-070rl-yageo-9297310; OctopartID: 5889910ea071874e; Mounting Style: Surface Mount; Supplier: Digi-Key; Case/Package: 0402; Footprint: PCB-oyb94b8sikd59g06l7z7-1; Supplier Part Number: 311-0.0LRCT-ND; Packaging: Tape & Reel; RoHS: Compliant
R16 R18 = CMP-1861820-2: YAGEO (PHYCOMP)   RL0402FR-070R15L   RESISTOR, 0402 0.063W 1% 0.15R; Lead-Free Status: Lead Free; Resistance: 0.15 Ω; Voltage Rating (DC): 50.0 V; Manufacturer Part Number: RL0402FR-070R15L; Case/Package: 0402; Mounting Style: Surface Mount; Number of Pins: 2; Octopart Url: https://octopart.com/rl0402fr-070r15l-yageo-39808442; OctopartID: cec9059c8615110e; Power Rating: 0.063 W; REACH SVHC Compliance: No SVHC; Resistance Tolerance: ±1%; RoHS: Compliant; Size-Height: 0.00035 m; Size-Length: 0.001 m; Size-Width: 0.0005 m
R17 = CMP-1861823-2: RESISTOR, 0402 0.063W 1% 0.47R; Manufacturer Part Number: RL0402FR-070R47L; Lead-Free Status: Lead Free; Resistance: 0.47 Ω; Voltage Rating (DC): 50.0 V; Case/Package: 0402; Mounting Style: Surface Mount; Number of Pins: 2; Octopart Url: https://octopart.com/rl0402fr-070r47l-yageo-39844317; OctopartID: 0221c974de9adde6; Power Rating: 0.063 W; REACH SVHC Compliance: No SVHC; Resistance Tolerance: ±1%; RoHS: Compliant; Size-Height: 0.00035 m; Size-Length: 0.001 m; Size-Width: 0.0005 m
R22 = CMP-1853094-10: Res General Purpose Thick Film 0402 100 Ohm 1% 1/16W ±100ppm/°C Molded SMD Paper T/R; Lead-Free Status: Lead Free; Power Rating: 62.5 mW; Voltage Rating (DC): 50.0 V; Temperature Coefficient: -100 ppm/°C to 100 ppm/°C; Resistance: 100 Ω; RoHS: Compliant; Mounting Style: Surface Mount; Number of Pins: 2; Size-Width: 500 µm; Octopart URL: https://octopart.com/rc0402fr-07100rl-yageo-40952494; Operating Temperature: 125 °C (max); REACH SVHC Compliance: No SVHC; Packaging: Tape & Reel; Resistance Tolerance: ±1%; Size-Height: 350 µm; Manufacturer Part Number: RC0402FR-07100RL; Size-Length: 1.00 mm; Footprint: PCB-f79v0kglkk96kqt11chf-1; OctopartID: ab8860f26c40744f; Case/Package: 0402
R25 = CMP-1900914-2: RES SMD 1K OHM 1% 1/16W 0402; Lead-Free Status: Lead Free; Resistance: 1000.0 Ω; Manufacturer Part Number: AC0402FR-071KL; Case/Package: 0402; Mounting Style: Surface Mount; Octopart Url: https://octopart.com/ac0402fr-071kl-yageo-21711078; OctopartID: fc2c346d91ac23eb; Resistance Tolerance: ±1%; RoHS: Compliant
R26 R29-R32 = CMP-1875343-2: RES SMD 10M OHM 5% 1/16W 0402; Manufacturer Part Number: RC0402JR-0710ML; Lead-Free Status: Lead Free; Power Rating: 0.0625 W; Resistance: 10000000.0 Ω; Voltage Rating (DC): 50.0 V; Case/Package: 0402; Mounting Style: Surface Mount; Number of Pins: 2; Octopart Url: https://octopart.com/rc0402jr-0710ml-yageo-44648968; OctopartID: b34d78eedc236c8a; Packaging: Cut Tape (CT); Resistance Tolerance: ±5%; RoHS: Compliant; Size-Length: 0.001 m
R27 R28 = CMP-1853188-3: Surface Mount Thick Film Resistor, RC Series, 180 kohm, 63 mW, - 1%, 50 V, 0402 [1005 Metric]; Manufacturer Part Number: RC0402FR-07180KL; Lead-Free Status: Lead Free; Resistance: 180 kΩ; Power Rating: 63.0 mW; Voltage Rating (DC): 50.0 V; Size-Length: 1.00 mm; Case/Package: 0402; RoHS: Compliant; Packaging: Cut Tape (CT); Size-Width: 500 µm; Seller Landing  Url: https://octopart-clicks.com/click/track?country=US&ak=8157f166&sig=0d1b890&sid=1106&ppid=40952506&vpid=198666476&ct=offers; Mounting Style: Surface Mount; Octopart Url: http://octopart.com/rc0402fr-07180kl-yageo-40952506; OctopartID: 1a8ed1f4dd52c549; Resistance Tolerance: ±1%; Size-Height: 350 µm; Number of Pins: 2; REACH SVHC Compliance: No SVHC
RF1 = CMP-aba463cbed747463-2: RF Amp Chip Single Low Noise Amplifier 1615MHz 3.6V 6-Pin TSLP T/R; Manufacturer Part Number: BGA725L6E6327FTSA1; Lead-Free Status: Lead Free; Gain: 20.0 dB; Supply Voltage (DC): 3.60 V (max), 1.50 V (min); Frequency: 1.62 GHz (max); Packaging: Reel, Tape & Reel (TR); OctopartID: aba463cbed747463; REACH SVHC Compliance: No SVHC; RoHS: Compliant; Octopart URL: https://octopart.com/bga725l6e6327ftsa1-infineon-23421878; Number of Pins: 6; Operating Temperature: -40.0 °C (min)
RTC1 = CMP-ea9a22bb0207355d-5: PCF8563 Series 1.8 - 5.5 V Real Time Clock / Calendar - SOIC-8; Lead-Free Status: Lead Free; Lifecycle Status: Active; OctopartID: ea9a22bb0207355d; Octopart URL: http://octopart.com/pcf8563t%2F5%2C518-nxp+semiconductors-19647995; RoHS: Compliant
SRAM1 = CMP-1396917-2: 256K, 32768x8-bit, 3.6V SPI Serial SRAM, 8-Pin SOIC 3.9mm, Industrial TemperatureTape and Reel; Lead-Free Status: Lead Free; Manufacturer Part Number: 23K256T-I/SN; Lifecycle Status: Active; Octopart Url: https://octopart.com/23k256t-i%2Fsn-microchip-12633955; OctopartID: 310af8c0d30feecd; RoHS: Compliant
Sw1 Sw2 = CMP-7016bb7c1e47afd1-1: Switch Tactile N.O. SPST Button J-Bend 0.05A 12VDC 1.6N SMD Embossed T/R; Manufacturer Part Number: EVQ-PSM02K; Actuator Type: Standard; Lead-Free Status: Lead Free; Contact Current Rating: 50.0 mA; Contacts Type: SPST-NO; Orientation: Right Angle; RoHS: Compliant; Size-Height: 1.80 mm; Size-Width: 4.00 mm; REACH SVHC Compliance: No SVHC; OctopartID: 7016bb7c1e47afd1; Lifecycle Status: Not Listed by Manufacturer; Mounting Style: Surface Mount; Octopart URL: http://octopart.com/evq-psm02k-panasonic-39865143; Size-Length: 6.10 mm; Packaging: Tape & Reel (TR)
U1 = CMP-d85f1088c3010798-2: LTC4120/LTC4120-4.2 - Wireless Power Receiver and 400mA Buck Battery Charger; Manufacturer Part Number: LTC4120EUD#PBF; Input Voltage (DC): 40.0 V; RoHS: Compliant; Case/Package: QFN; Octopart URL: http://octopart.com/ltc4120eud%23pbf-linear+technology-31276600; OctopartID: d85f1088c3010798; Number of Pins: 16; Mounting Style: Surface Mount
U2 = CMP-677eaca2fd91b8b9-2: Pulse Oximeter and Heart-Rate Sensor IC 14-Pin OLGA; Supply Voltage (DC): 1.70 V (min); Footprint: PCB-h4syjc3j3ba491jqt4t0-1; Manufacturer Part Number: MAX30100EFD+; Number of Pins: 14; OctopartID: 677eaca2fd91b8b9; Octopart URL: http://octopart.com/max30100efd%2B-maxim+integrated-47628169; Lifecycle Status: Not Listed by Manufacturer; RoHS: Compliant
U3 = CMP-1313603-13: Microcontroller Solutions - Interface Products USB-TO-UART BRIDGE; Lead-Free Status: Lead Free; Supply Voltage (DC): 3.00 V (min), 3.60 V (max); Supply Current: 100 mA; Octopart URL: https://octopart.com/cp2102-gmr-silicon+labs-713744; Manufacturer Part Number: CP2102-GMR; Operating Temperature: -40.0 °C (min); OctopartID: 97e45ee456924823; RoHS: Compliant; Packaging: Reel; Mounting Style: Surface Mount; Footprint: PCB-fk1g971c1w1fvmpyhdz6-1; Case/Package: MLP
U4 = CMP-0062-02036-3: Micropower 150 mA Low-Noise Ultra Low-Dropout Regulator, 5-pin SOT-23, Pb-Free; Dropout Voltage: 0.28 V; Lead-Free Status: Lead Free; Number of Outputs: 1; Output Capacitor Type: Ceramic; Output Current: 0.15 A; Output Voltage: 3.6 V; Quiescent Current: 6.5e-05 A; Manufacturer Part Number: LP2985AIM5-3.6/NOPB; Lifecycle Status: Active; Mounting Style: Surface Mount; Number of Pins: 5; Number of Regulated Outputs: 1; Octopart Url: https://octopart.com/lp2985aim5-3.6%2Fnopb-texas+instruments-24816298; OctopartID: 350cfd7cbac0eacb; REACH SVHC Compliance: No SVHC; RoHS: Compliant
U5 = CMP-2b8de2d6d0ddf44a-2: SMD PMIC; DC-DC; Vin 2.6-5.5V; Adj; 2A; 3MHz; Buck; 1-Ch; Output Voltage: 1.8 V; Power Rating: 0.25 W; Input Voltage (DC): 6.0 V; Number of Outputs: 1; Dropout Voltage: 0.4 V; Output Current: 0.25 A; REACH SVHC Compliance: No SVHC; Manufacturer Part Number: XC6206P182MR; Number of Pins: 3; Octopart Url: http://octopart.com/xc6206p182mr-torex-5365302; Packaging: Cut Tape (CT); Seller Landing  Url: https://octopart-clicks.com/click/track?country=US&ak=8157f166&sig=0a4f951&sid=2402&ppid=5365302&vpid=6617035&ct=offers; OctopartID: 2b8de2d6d0ddf44a; RoHS: Compliant
U6 = CMP-1503624-2: Single Output LDO, 200 mA, Fixed 2.8 V Output, 2 to 5.5 V Input, with Low IQ, 5-pin SC70 (DCK), -40 to 125 degC, Green (RoHS & no Sb/Br); Dropout Voltage: 0.175 V; Lead-Free Status: Lead Free; Number of Regulated Outputs: 1; Output Capacitor Type: Ceramic; Quiescent Current: 3e-05 A; Manufacturer Part Number: TLV70028DCKR; Lifecycle Status: Active; Octopart Url: https://octopart.com/tlv70028dckr-texas+instruments-12191380; OctopartID: e6f82f48c50a393f; RoHS: Compliant
U7 = CMP-0370cecba49cdcb7-1: Low-loss RF GPS + COMPASS + Galileo + GLONASS filter 1582.4 MHz; Lead-Free Status: Lead Free; Octopart Url: https://octopart.com/b39162b4327p810-rf360+holdings-78742154; OctopartID: 0370cecba49cdcb7; Manufacturer Part Number: B39162B4327P810; RoHS: Compliant
Y1 = CMP-lm3x3di7cwhelc99d68i-2: CustomComponentID: lm3x3di7cwhelc99d68i
Y2 = CMP-6073a867ade6bfb4-1: Crystal 40MHz ?10ppm (Tol) ?10ppm (Stability) 10pF FUND 60Ohm 4-Pin SMD T/R; Manufacturer Part Number: 7M-40.000MEEQ-T; Load Capacitance: 10.0 pF; Lead-Free Status: Lead Free; Frequency: 40.0 MHz; OctopartID: 6073a867ade6bfb4; RoHS: Compliant; Mounting Style: Surface Mount; Octopart URL: http://octopart.com/7m-40.000meeq-t-txc-18802931; Number of Pins: 4